# Altium schematic sheet Microcontroller.SchDoc: Main Microcontroller & FOTA Microcontroller
size A3; SheetNumber: 15; SheetTotal: 37
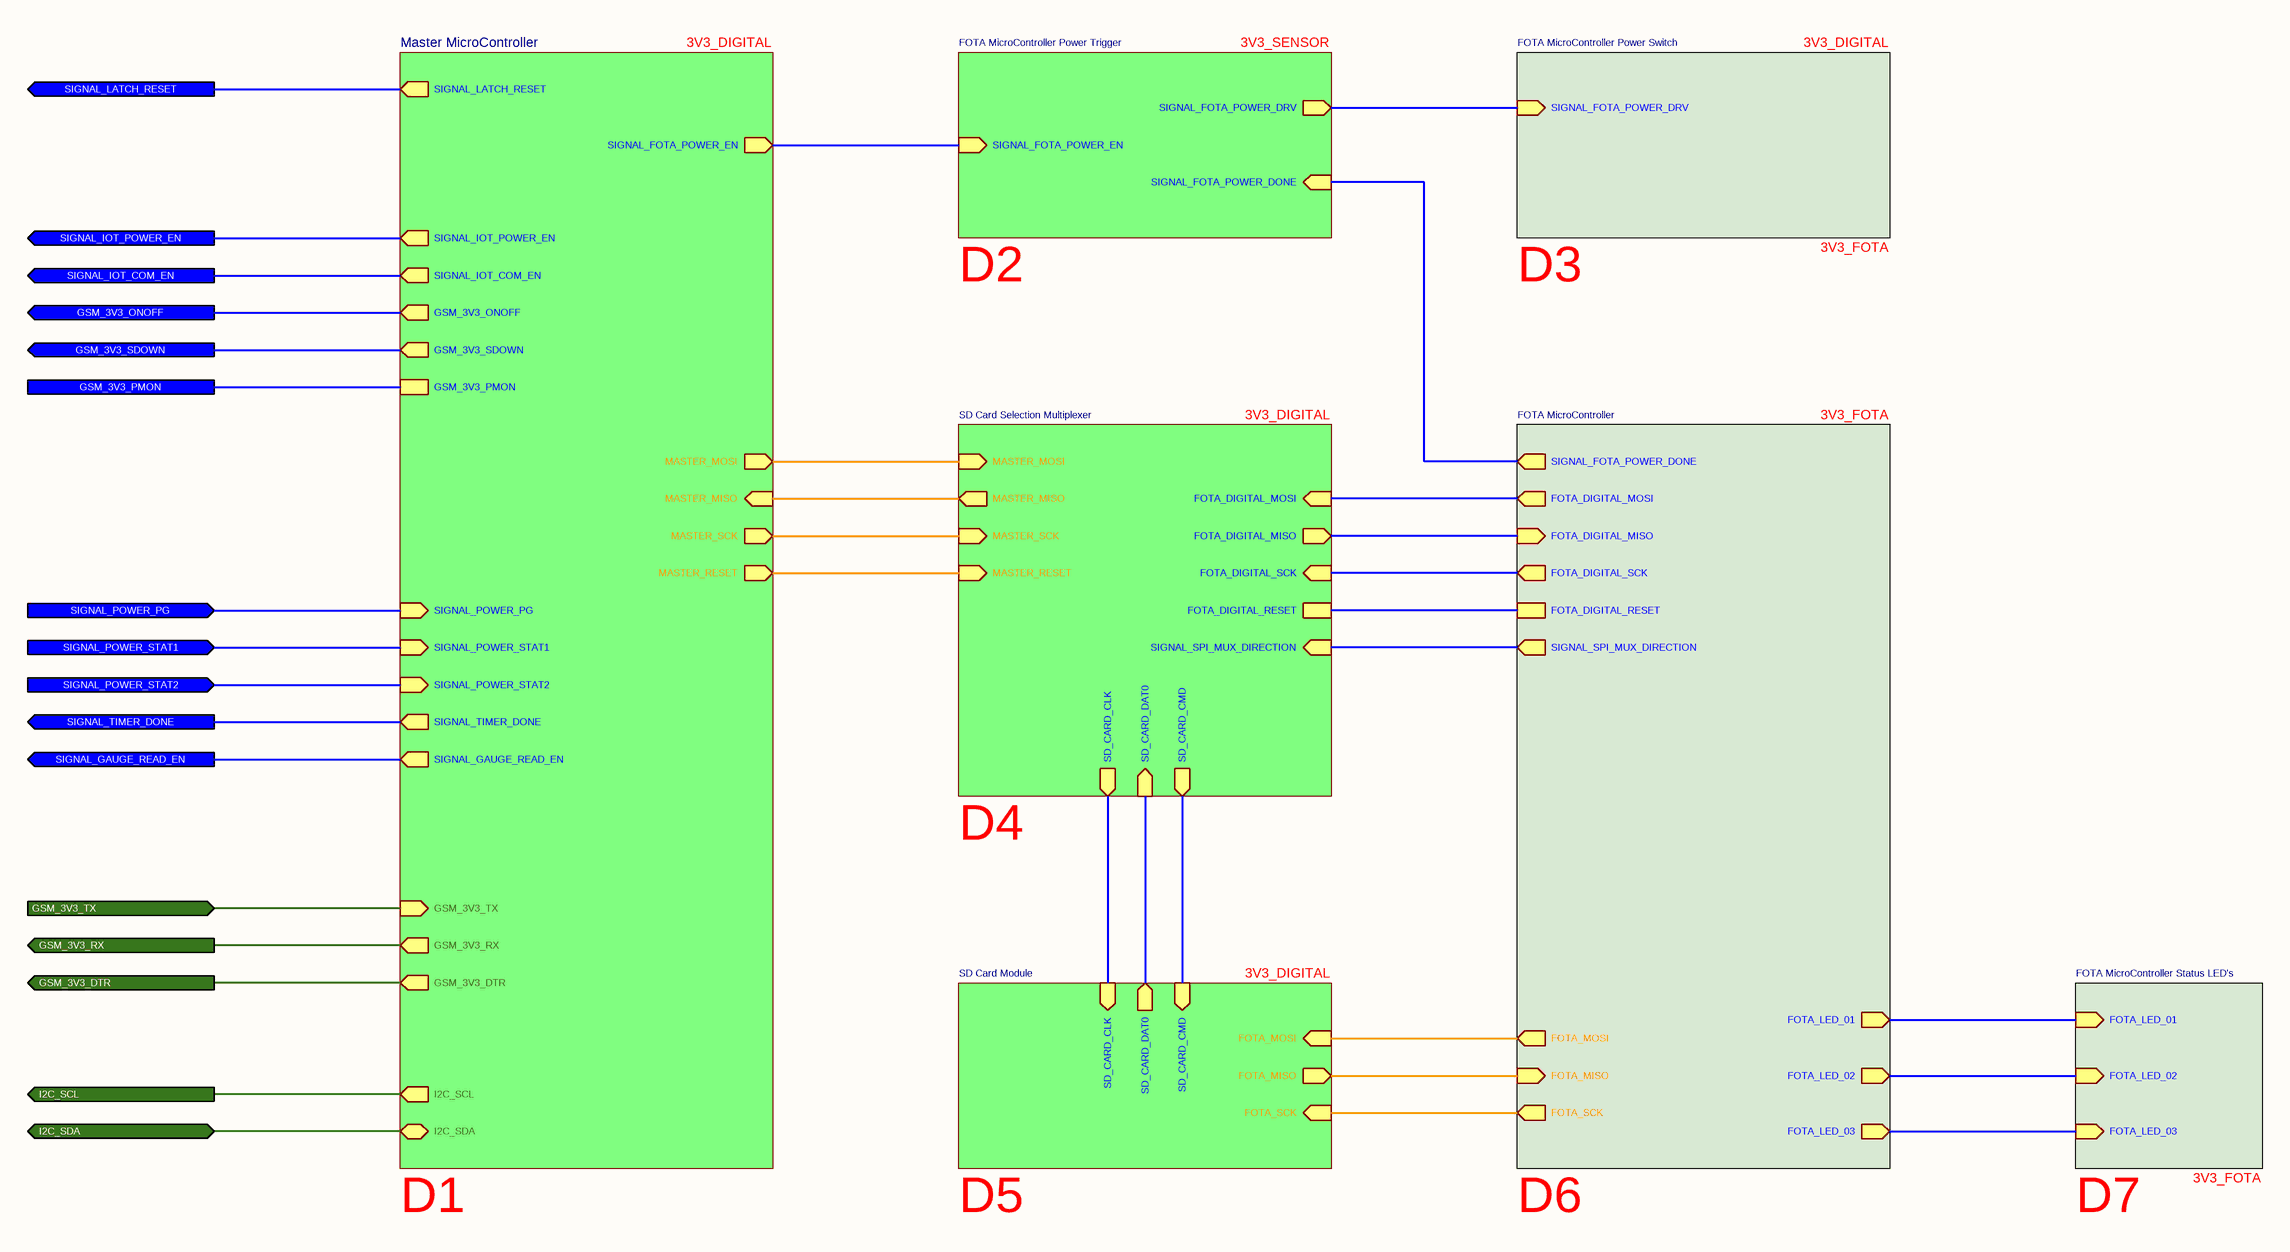
[diagram p0: Microcontroller.SchDoc]

## Sub-sheets
FOTA MicroController = FOTA MicroController.SchDoc: FOTA_LED_02 (out), FOTA_LED_03 (out), FOTA_LED_01 (out), SIGNAL_SPI_MUX_DIRECTION (out), SIGNAL_FOTA_POWER_DONE (out), FOTA_MOSI (out), FOTA_MISO (in), FOTA_SCK (out), FOTA_DIGITAL_SCK (out), FOTA_DIGITAL_MISO (in), FOTA_DIGITAL_RESET, FOTA_DIGITAL_MOSI (out)
FOTA MicroController Power Switch = FOTA MicroController Power Switch.SchDoc: SIGNAL_FOTA_POWER_DRV (in)
FOTA MicroController Power Trigger = FOTA MicroController Power Trigger.SchDoc: SIGNAL_FOTA_POWER_DRV (out), SIGNAL_FOTA_POWER_EN (in), SIGNAL_FOTA_POWER_DONE (in)
FOTA MicroController Status LED's = FOTA MicroController Status LEDs.SchDoc: FOTA_LED_01 (in), FOTA_LED_02 (in), FOTA_LED_03 (in)
Master MicroController = Master MicroController.SchDoc: SIGNAL_FOTA_POWER_EN (out), SIGNAL_IOT_POWER_EN (out), GSM_3V3_SDOWN (out), GSM_3V3_ONOFF (out), GSM_3V3_PMON, SIGNAL_IOT_COM_EN (out), I2C_SCL (out), I2C_SDA (bidir), GSM_3V3_TX (in), GSM_3V3_RX (out), MASTER_MOSI (out), MASTER_RESET (out), MASTER_SCK (out), MASTER_MISO (in), SIGNAL_POWER_PG (in), SIGNAL_POWER_STAT1 (in), SIGNAL_POWER_STAT2 (in), SIGNAL_LATCH_RESET (out), SIGNAL_TIMER_DONE (out), SIGNAL_GAUGE_READ_EN (out), GSM_3V3_DTR (out)
SD Card Module = SD Card Module.SchDoc: SD_CARD_CLK (in), SD_CARD_CMD (in), SD_CARD_DAT0 (out), FOTA_MISO (out), FOTA_MOSI (in), FOTA_SCK (in)
SD Card Selection Multiplexer = SD Card Selection Multiplexer.SchDoc: SIGNAL_SPI_MUX_DIRECTION (in), MASTER_MOSI (in), MASTER_RESET (in), MASTER_MISO (out), MASTER_SCK (in), FOTA_DIGITAL_SCK (in), SD_CARD_CMD (out), FOTA_DIGITAL_MOSI (in), SD_CARD_DAT0 (in), SD_CARD_CLK (out), FOTA_DIGITAL_RESET, FOTA_DIGITAL_MISO (out)

## Ports
GSM_3V3_DTR (out), GSM_3V3_ONOFF (out), GSM_3V3_PMON, GSM_3V3_RX (out), GSM_3V3_SDOWN (out), GSM_3V3_TX (in), I2C_SCL (out), I2C_SDA (bidir), SIGNAL_GAUGE_READ_EN (out), SIGNAL_IOT_COM_EN (out), SIGNAL_IOT_POWER_EN (out), SIGNAL_LATCH_RESET (out), SIGNAL_POWER_PG (in), SIGNAL_POWER_STAT1 (in), SIGNAL_POWER_STAT2 (in), SIGNAL_TIMER_DONE (out)

## Nets
GSM_3V3_DTR: port GSM_3V3_DTR, sheet Master MicroController/GSM_3V3_DTR
GSM_3V3_ONOFF: port GSM_3V3_ONOFF, sheet Master MicroController/GSM_3V3_ONOFF
GSM_3V3_PMON: port GSM_3V3_PMON, sheet Master MicroController/GSM_3V3_PMON
GSM_3V3_RX: port GSM_3V3_RX, sheet Master MicroController/GSM_3V3_RX
GSM_3V3_SDOWN: port GSM_3V3_SDOWN, sheet Master MicroController/GSM_3V3_SDOWN
GSM_3V3_TX: port GSM_3V3_TX, sheet Master MicroController/GSM_3V3_TX
I2C_SCL: port I2C_SCL, sheet Master MicroController/I2C_SCL
I2C_SDA: port I2C_SDA, sheet Master MicroController/I2C_SDA
SIGNAL_GAUGE_READ_EN: port SIGNAL_GAUGE_READ_EN, sheet Master MicroController/SIGNAL_GAUGE_READ_EN
SIGNAL_IOT_COM_EN: port SIGNAL_IOT_COM_EN, sheet Master MicroController/SIGNAL_IOT_COM_EN
SIGNAL_IOT_POWER_EN: port SIGNAL_IOT_POWER_EN, sheet Master MicroController/SIGNAL_IOT_POWER_EN
SIGNAL_LATCH_RESET: port SIGNAL_LATCH_RESET, sheet Master MicroController/SIGNAL_LATCH_RESET
SIGNAL_POWER_PG: port SIGNAL_POWER_PG, sheet Master MicroController/SIGNAL_POWER_PG
SIGNAL_POWER_STAT1: port SIGNAL_POWER_STAT1, sheet Master MicroController/SIGNAL_POWER_STAT1
SIGNAL_POWER_STAT2: port SIGNAL_POWER_STAT2, sheet Master MicroController/SIGNAL_POWER_STAT2
SIGNAL_TIMER_DONE: port SIGNAL_TIMER_DONE, sheet Master MicroController/SIGNAL_TIMER_DONE
(unnamed): sheet Master MicroController/SIGNAL_FOTA_POWER_EN, sheet FOTA MicroController Power Trigger/SIGNAL_FOTA_POWER_EN
(unnamed): sheet Master MicroController/MASTER_MOSI, sheet SD Card Selection Multiplexer/MASTER_MOSI
(unnamed): sheet Master MicroController/MASTER_RESET, sheet SD Card Selection Multiplexer/MASTER_RESET
(unnamed): sheet Master MicroController/MASTER_SCK, sheet SD Card Selection Multiplexer/MASTER_SCK
(unnamed): sheet Master MicroController/MASTER_MISO, sheet SD Card Selection Multiplexer/MASTER_MISO
(unnamed): sheet FOTA MicroController Power Trigger/SIGNAL_FOTA_POWER_DRV, sheet FOTA MicroController Power Switch/SIGNAL_FOTA_POWER_DRV
(unnamed): sheet FOTA MicroController Power Trigger/SIGNAL_FOTA_POWER_DONE, sheet FOTA MicroController/SIGNAL_FOTA_POWER_DONE
(unnamed): sheet SD Card Selection Multiplexer/SIGNAL_SPI_MUX_DIRECTION, sheet FOTA MicroController/SIGNAL_SPI_MUX_DIRECTION
(unnamed): sheet SD Card Selection Multiplexer/FOTA_DIGITAL_SCK, sheet FOTA MicroController/FOTA_DIGITAL_SCK
(unnamed): sheet SD Card Selection Multiplexer/SD_CARD_CMD, sheet SD Card Module/SD_CARD_CMD
(unnamed): sheet SD Card Selection Multiplexer/FOTA_DIGITAL_MOSI, sheet FOTA MicroController/FOTA_DIGITAL_MOSI
(unnamed): sheet SD Card Selection Multiplexer/SD_CARD_DAT0, sheet SD Card Module/SD_CARD_DAT0
(unnamed): sheet SD Card Selection Multiplexer/SD_CARD_CLK, sheet SD Card Module/SD_CARD_CLK
(unnamed): sheet SD Card Selection Multiplexer/FOTA_DIGITAL_RESET, sheet FOTA MicroController/FOTA_DIGITAL_RESET
(unnamed): sheet SD Card Selection Multiplexer/FOTA_DIGITAL_MISO, sheet FOTA MicroController/FOTA_DIGITAL_MISO
(unnamed): sheet SD Card Module/FOTA_MISO, sheet FOTA MicroController/FOTA_MISO
(unnamed): sheet SD Card Module/FOTA_MOSI, sheet FOTA MicroController/FOTA_MOSI
(unnamed): sheet SD Card Module/FOTA_SCK, sheet FOTA MicroController/FOTA_SCK
(unnamed): sheet FOTA MicroController/FOTA_LED_02, sheet FOTA MicroController Status LED's/FOTA_LED_02
(unnamed): sheet FOTA MicroController/FOTA_LED_03, sheet FOTA MicroController Status LED's/FOTA_LED_03
(unnamed): sheet FOTA MicroController/FOTA_LED_01, sheet FOTA MicroController Status LED's/FOTA_LED_01

## Notes on the sheet
- 3V3_DIGITAL
- 3V3_SENSOR
- 3V3_FOTA
- D2
- D3
- D4
- D1
- D5
- D6
- D7
- Title
- Size:
- Date:
- A3
- Number:
- Time:
- Revision:
- Sheet
- of
- File: